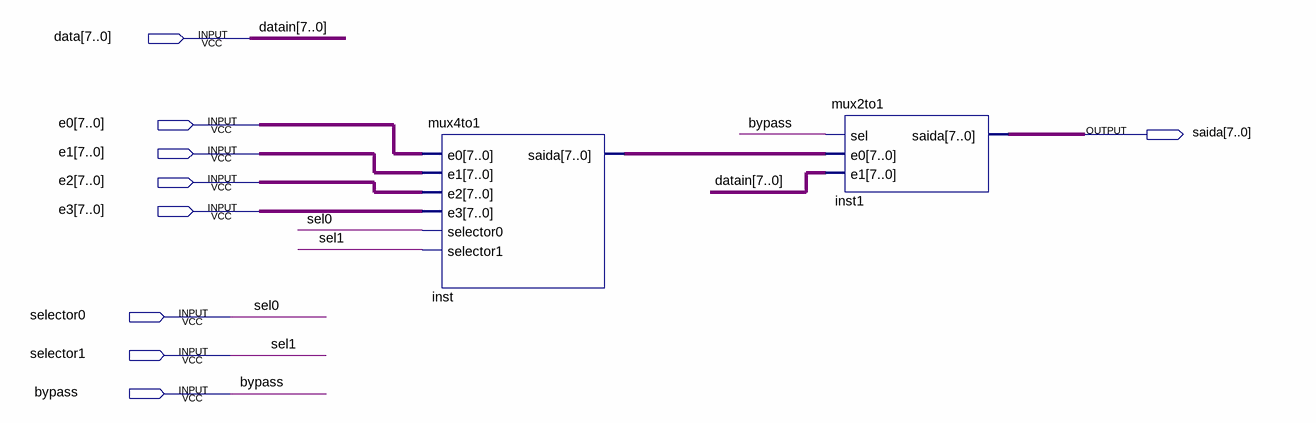
[diagram p0: schematic sheet]
// Quartus schematic mux_ula.bdf as structural Verilog: 2 symbols, 9 pins
module mux_ula (
  input  [7:0] data,
  input  [7:0] e0,
  input  [7:0] e1,
  input  [7:0] e2,
  input  [7:0] e3,
  input  selector0,
  input  selector1,
  input  bypass,
  output [7:0] saida
);

  wire [7:0] inst_saida;

  mux4to1 inst (.e0(e0), .e1(e1), .e2(e2), .e3(e3), .selector0(selector0), .selector1(selector1), .saida(inst_saida));
  mux2to1 inst1 (.sel(bypass), .e0(inst_saida), .e1(data), .saida(saida));

  // Other names for the same wires on the sheet: datain[7:0] = data; sel0 = selector0; sel1 = selector1
endmodule
